# Altium project 2025001 B Soutra Plainsong Metronome.PrjPcb (part 2 of 3)

## Sheet MCU.SchDoc: Plainsong Metronome
size A4; SheetNumber: 5; SheetTotal: 9
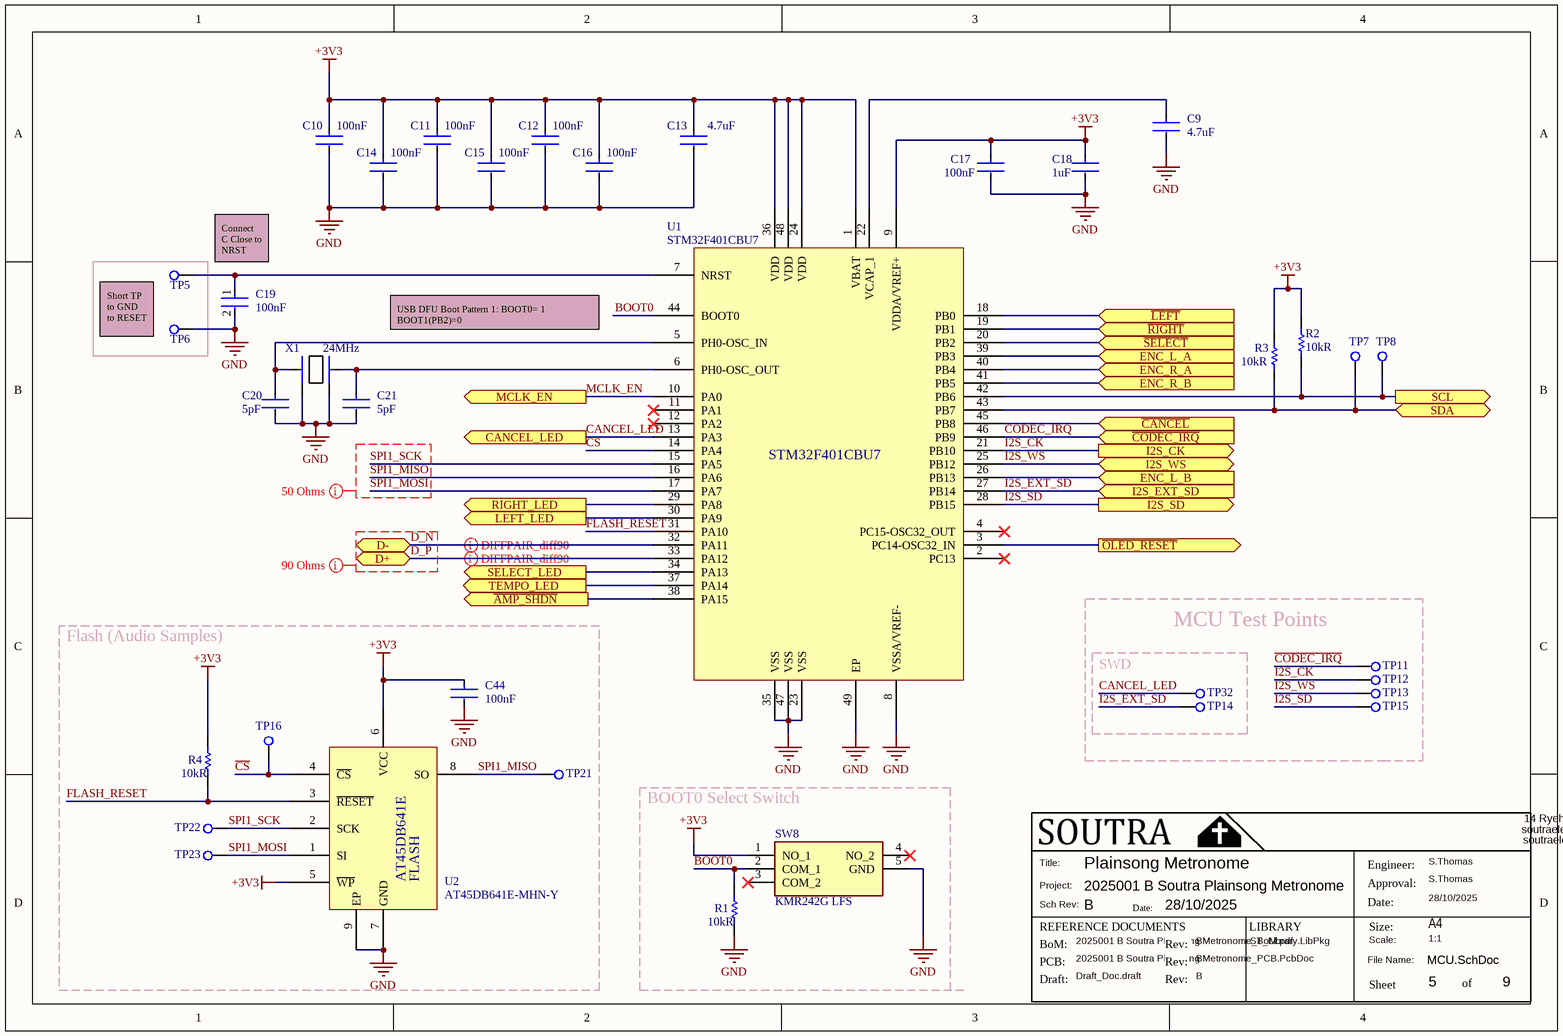
[diagram p5: MCU.SchDoc]

### Parts
C9  value 4.7uF  [CC1206-IPC_A]  (hidden comment: CL31B475KAHNNNE)
C10  value 100nF  [CAPC1005X06L]  (hidden comment: 0402X104M160CT)
C11  value 100nF  [CAPC1005X06L]  (hidden comment: 0402X104M160CT)
C12  value 100nF  [CAPC1005X06L]  (hidden comment: 0402X104M160CT)
C13  value 4.7uF  [CC1206-IPC_A]  (hidden comment: CL31B475KAHNNNE)
C14  value 100nF  [CAPC1005X06L]  (hidden comment: 0402X104M160CT)
C15  value 100nF  [CAPC1005X06L]  (hidden comment: 0402X104M160CT)
C16  value 100nF  [CAPC1005X06L]  (hidden comment: 0402X104M160CT)
C17  value 100nF  [CAPC1005X06L]  (hidden comment: 0402X104M160CT)
C18  value 1uF  [CAPC1005X06L]  (hidden comment: CC0402KRX5R6BB105)
C19  value 100nF  [CAPC1005X06L]  (hidden comment: 0402X104M160CT)
C20  value 5pF  [CAPC1005X06L]  (hidden comment: CC0402CRNPO9BN5R0)
C21  value 5pF  [CAPC1005X06L]  (hidden comment: CC0402CRNPO9BN5R0)
C44  value 100nF  [CAPC1005X06L]  (hidden comment: 0402X104M160CT)
R1  value 10kR  [RESC_0805_2013X50X30LL20T20]  (hidden comment: RC0805JR-0710KL)
R2  value 10kR  [RESC_0603_1608X06L]  (hidden comment: RK73B1JTTD103J)
R3  value 10kR  [RESC_0603_1608X06L]  (hidden comment: RK73B1JTTD103J)
R4  value 10kR  [RESC_0805_2013X50X30LL20T20]  (hidden comment: RC0805JR-0710KL)
SW8  KMR242G LFS  [KMR242GLFS]
TP5  TP_CIRCLE_R1  [TP_CIRCLE_R1]  (value not drawn)
TP6  TP_CIRCLE_R1  [TP_CIRCLE_R1]  (value not drawn)
TP7  TP_CIRCLE_R1  [TP_CIRCLE_R1]  (value not drawn)
TP8  TP_CIRCLE_R1  [TP_CIRCLE_R1]  (value not drawn)
TP11  TP_CIRCLE_R1  [TP_CIRCLE_R1]  (value not drawn)
TP12  TP_CIRCLE_R1  [TP_CIRCLE_R1]  (value not drawn)
TP13  TP_CIRCLE_R1  [TP_CIRCLE_R1]  (value not drawn)
TP14  TP_CIRCLE_R1  [TP_CIRCLE_R1]  (value not drawn)
TP15  TP_CIRCLE_R1  [TP_CIRCLE_R1]  (value not drawn)
TP16  TP_CIRCLE_R1  [TP_CIRCLE_R1]  (value not drawn)
TP21  TP_CIRCLE_R1  [TP_CIRCLE_R1]  (value not drawn)
TP22  TP_CIRCLE_R1  [TP_CIRCLE_R1]  (value not drawn)
TP23  TP_CIRCLE_R1  [TP_CIRCLE_R1]  (value not drawn)
TP32  TP_CIRCLE_R1  [TP_CIRCLE_R1]  (value not drawn)
U1  STM32F401CBU7  [UFQFPN50P700X700X60_HS-49L]
U2  AT45DB641E-MHN-Y  [QFN127P600X500X60_HS-9L]
X1  value 24MHz  [OSCSC1-85x1-55P2-55X2-05Y0-05_4MFR]  (hidden comment: MCSJK-7E-24.00-8-10-60-B-10)

### Blocks framed on the sheet
Flash (Audio Samples): C44 R4 TP16 TP21-TP23 U2
MCU Test Points: TP11-TP13 TP15
SWD: TP14 TP32

### Ports
CANCEL_LED (out, see Block Diagram[2C], IOb[3B]), D+ (bidir, see Block Diagram[3C], IOa[2A]), D- (bidir, see Block Diagram[3C], IOa[2A]), ENC_L_A (in, see Block Diagram[2C], IOb[2C]), ENC_L_B (in, see Block Diagram[2C], IOb[2C]), ENC_R_A (in, see Block Diagram[2C], IOb[2A]), ENC_R_B (in, see Block Diagram[2C], IOb[2B]), I2S_CK (out, see Block Diagram[3A], CODEC[2B]), I2S_EXT_SD (in, see Block Diagram[3A], CODEC[3B]), I2S_SD (out, see Block Diagram[3B], CODEC[2B]), I2S_WS (bidir, see Block Diagram[3A], CODEC[2B]), LEFT_LED (out, see Block Diagram[2C], IOb[2B]), MCLK_EN (out, see Block Diagram[3B], CODEC[1B]), RIGHT_LED (out, see Block Diagram[2C], IOb[4B]), SCL (out, see Block Diagram[3B], CODEC[2B], IOa[1C]), SDA (bidir, see Block Diagram[3B], CODEC[2B], IOa[1C]), SELECT_LED (out, see Block Diagram[2C], IOb[3B]), TEMPO_LED (out, see Block Diagram[2B], IOb[4B]), ~{AMP_SHDN} (out, see Block Diagram[3B], Amplifiers[1B]), ~{CANCEL} (in, see Block Diagram[2C], IOb[3A]), ~{CODEC_IRQ} (in, see Block Diagram[3B], CODEC[3B]), ~{LEFT} (in, see Block Diagram[2B], IOb[3A]), ~{OLED_RESET} (out, see Block Diagram[3C], IOa[1C]), ~{RIGHT} (in, see Block Diagram[2C], IOb[4A]), ~{SELECT} (in, see Block Diagram[2B], IOb[3A])

### Nets
+3V3: C10.1 C11.1 C12.1 C13.1 C14.1 C15.1 C16.1 C17.1 C18.1 C44.1 R2.2 R3.2 R4.2 SW8.1(NO_1) U1.1(VBAT) U1.9(VDDA/VREF+) U1.24(VDD) U1.36(VDD) U1.48(VDD) U2.5(~{WP}) U2.6(VCC)
GND: C9.2 C10.2 C11.2 C12.2 C13.2 C14.2 C15.2 C16.2 C17.2 C18.2 C19.2 C20.2 C21.2 C44.2 R1.1 SW8.5(GND) TP6.1 U1.8(VSSA/VREF-) U1.23(VSS) U1.35(VSS) U1.47(VSS) U1.49(EP) U2.7(GND) U2.9(EP) X1.2 X1.4
~{AMP_SHDN}: U1.38(PA15) ; port ~{AMP_SHDN}
~{CODEC_IRQ}: TP11.1 U1.46(PB9) ; port ~{CODEC_IRQ}
~{CS}: TP16.1 U1.14(PA4) U2.4(~{CS})
BOOT0: R1.2 SW8.2(COM_1) U1.44(BOOT0)
CANCEL_LED: TP32.1 U1.13(PA3) ; port CANCEL_LED
D_N: U1.32(PA11) ; port D-
D_P: U1.33(PA12) ; port D+
FLASH_RESET: R4.1 U1.31(PA10) U2.3(~{RESET})
I2S_CK: TP12.1 U1.21(PB10) ; port I2S_CK
I2S_EXT_SD: TP14.1 U1.27(PB14) ; port I2S_EXT_SD
I2S_SD: TP15.1 U1.28(PB15) ; port I2S_SD
I2S_WS: TP13.1 U1.25(PB12) ; port I2S_WS
MCLK_EN: U1.10(PA0) ; port MCLK_EN
SPI1_MISO: TP21.1 U1.16(PA6) U2.8(SO)
SPI1_MOSI: TP23.1 U1.17(PA7) U2.1(SI)
SPI1_SCK: TP22.1 U1.15(PA5) U2.2(SCK)
NetC9_1: C9.1 U1.22(VCAP_1)
NetC19_1: C19.1 TP5.1 U1.7(NRST)
NetC20_1: C20.1 U1.5(PH0-OSC_IN) X1.1
NetC21_1: C21.1 U1.6(PH0-OSC_OUT) X1.3
NetJ6_16: U1.3(PC14-OSC32_IN) ; port ~{OLED_RESET}
NetJ6_20: R2.1 TP8.1 U1.42(PB6) ; port SCL
NetJ6_21: R3.1 TP7.1 U1.43(PB7) ; port SDA
NetR32_1: U1.41(PB5) ; port ENC_R_B
NetR33_1: U1.40(PB4) ; port ENC_R_A
NetR34_1: U1.18(PB0) ; port ~{LEFT}
NetR35_1: U1.20(PB2) ; port ~{SELECT}
NetR36_1: U1.45(PB8) ; port ~{CANCEL}
NetR37_1: U1.19(PB1) ; port ~{RIGHT}
NetR38_1: U1.30(PA9) ; port LEFT_LED
NetR39_1: U1.34(PA13) ; port SELECT_LED
NetR41_1: U1.29(PA8) ; port RIGHT_LED
NetR43_1: U1.26(PB13) ; port ENC_L_B
NetR44_1: U1.39(PB3) ; port ENC_L_A
NetR45_1: U1.37(PA14) ; port TEMPO_LED

Not connected (* = marked no-connect by the designer): SW8 3(COM_2)* 4(NO_2)*; U1 2(PC13)* 4(PC15-OSC32_OUT)* 11(PA1)* 12(PA2)*

### Layout directives
mark named 90 Ohms: D_N, D_P
rule Width Constraint [Pref Impedance = 50.00ohms    Min Impedance = 50.00ohms    Max Impedance = 50.00ohms]: SPI1_MISO, SPI1_MOSI, SPI1_SCK
differential pair; differential pair class diff90; differential pair; differential pair: D_N, D_P

### Notes on the sheet
- Connect C Close to NRST
- Short TP to GND to RESET
- USB DFU Boot Pattern 1: BOOT0= 1    BOOT1(PB2)=0
- (near SW8) BOOT0 Select Switch
- Title:
- Project:
- Sch Rev:
- Date:
- Engineer:
- Approval:
- REFERENCE DOCUMENTS
- BoM:
- PCB:
- Draft:
- Rev:
- LIBRARY
- File Name:
- Scale:
- Size:
- Sheet
- A4
- of
- (in symbol AT45DB641E-MHN-Y) AT45DB641E

### Library data of the parts
C9 C13 = CL31B475KAHNNNE: Ceramic Capacitor, Multilayer, Ceramic, 25V, 10% +Tol, 10% -Tol, X7R, 15% TC, 4.7uF, Surface Mount, 1206; Manufacturer: Samsung; Multilayer: Yes; Supplier: Digikey; Supplier Part Number: 1276-1055-1-ND; Manufacturer Part Number: CL31B475KAHNNNE; RoHS: Yes; Category: Ceramic Capacitors; Stock: 245034; Pricing: 1=0.18, 10=0.116, 50=0.0732, 100=0.0585, 500=0.04228, 1000=0.0374 (USD); Mounting Technology: Surface Mount; Pins: 2; Dielectric Material: Ceramic; Package Shape: Rectangular; Case/Package: 1206; Terminal Finish: Nickel; Min Operating Temperature: -55°C; Max Operating Temperature: 125°C; JESD-609 Code: e3; Capacitor Type: Ceramic; Tolerance  (fill in as +-): 10%; Package Style: SMTMeter; Packaging: Tape and Reel; Tolerance (fill in as +-): 10%; Rated DC Voltage (URdc): 25V; Temperature Characteristics Code: X7R; Termination: Wraparound; Length: 3.2mm; Width: 1.6mm; Height: 1.8mm; Reach SVHC Compliant: Yes; RoHS Compliant: Yes; ComponentLink1URL: https://datasheet.ciiva.com:443/pdfs/VipMasterIC/IC/SEMS/SEMS-S-A0008522756/SEMS-S-A0008522493-1.pdf?src-supplier=IHS+Markit; ComponentLink1Description: https://datasheet.ciiva.com:443/pdfs/VipMasterIC/IC/SEMS/SEMS-S-A0008522756/SEMS-S-A0008522493-1.pdf?src-supplier=IHS+Markit; ComponentLink2URL: https://datasheet.ciiva.com/25728/cl31b475kahnnne-25728538.pdf?src-supplier=Digikey; ComponentLink2Description: https://datasheet.ciiva.com/25728/cl31b475kahnnne-25728538.pdf?src-supplier=Digikey; ComponentLink3URL: https://datasheet.ciiva.com/29200/452772-da-01-en-vs-kondensator-1206-29200897.pdf?src-supplier=Conrad; ComponentLink3Description: https://datasheet.ciiva.com/29200/452772-da-01-en-vs-kondensator-1206-29200897.pdf?src-supplier=Conrad; ComponentLink4URL: https://datasheet.ciiva.com/29200/452785-da-01-en-vs-kondensator-1206-29200901.pdf?src-supplier=Conrad; ComponentLink4Description: https://datasheet.ciiva.com/29200/452785-da-01-en-vs-kondensator-1206-29200901.pdf?src-supplier=Conrad; ComponentLink5URL: https://datasheet.ciiva.com/26310/mlcc-catalogdownload2013-eng-26310092.pdf?src-supplier=Distrelec; ComponentLink5Description: https://datasheet.ciiva.com/26310/mlcc-catalogdownload2013-eng-26310092.pdf?src-supplier=Distrelec; ComponentLink6URL: https://datasheet.ciiva.com/16428/cl10c1r5bb8nnnc-16428942.pdf?src-supplier=Future+Electronics; ComponentLink6Description: https://datasheet.ciiva.com/16428/cl10c1r5bb8nnnc-16428942.pdf?src-supplier=Future+Electronics; Supplier 1: Farnell; Supplier Part Number 1: 3013532; Pricing 1: 5=0.08, 50=0.05
C10-C12 C14-C17 C19 C44 = 0402X104M160CT: Ceramic Capacitor, Multilayer, Ceramic, 16V, 20% +Tol, 20% -Tol, X5R, 15% TC, 0.1uF, Surface Mount, 0402; Manufacturer: Walsin Technologies; Alternative Part: 885012105016; Alternative Part Manufacturer: WURTH; Multilayer: Yes; Supplier: Farnell; Supplier Part Number: 2524808; Manufacturer Part Number: 0402X104M160CT; RoHS: Yes; Category: Ceramic Capacitors; Stock: 1101; Pricing: 10=0.0047, 100=0.0043; Mounting Technology: Surface Mount; Pins: 2; Dielectric Material: Ceramic; Package Shape: Rectangular; Case/Package: 0402; Terminal Finish: Nickel; Min Operating Temperature: -55°C; Max Operating Temperature: 85°C; JESD-609 Code: e3; Capacitor Type: Ceramic; Tolerance  (fill in as +-): 20%; Package Style: SMTMeter; Packaging: Tape and Reel; Tolerance (fill in as +-): 20%; Rated DC Voltage (URdc): 16V; Temperature Characteristics Code: X5R; Termination: Wraparound; Length: 1mm; Width: 0.5mm; Height: 0.5mm; Reach SVHC Compliant: Yes; RoHS Compliant: Yes; ComponentLink1URL: https://datasheet.ciiva.com:443/pdfs/VipMasterIC/IC/WATC/WATC-S-A0009550342/WATC-S-A0009550342-1.pdf?src-supplier=IHS+Markit; ComponentLink1Description: https://datasheet.ciiva.com:443/pdfs/VipMasterIC/IC/WATC/WATC-S-A0009550342/WATC-S-A0009550342-1.pdf?src-supplier=IHS+Markit; ComponentLink2URL: http://www.farnell.com/datasheets/2009679.pdf?src-supplier=Farnell; ComponentLink2Description: http://www.farnell.com/datasheets/2009679.pdf?src-supplier=Farnell; ComponentLink3URL: http://www.farnell.com/datasheets/2340522.pdf?src-supplier=Farnell; ComponentLink3Description: http://www.farnell.com/datasheets/2340522.pdf?src-supplier=Farnell; ComponentLink4URL: https://datasheet.octopart.com/0402X104M160CT-Walsin-Technologies-datasheet-85392065.pdf?src-supplier=Element14; ComponentLink4Description: https://datasheet.octopart.com/0402X104M160CT-Walsin-Technologies-datasheet-85392065.pdf?src-supplier=Element14; ComponentLink5URL: https://datasheet.octopart.com/0402X104M160CT-Walsin-Technologies-datasheet-136037192.pdf?src-supplier=TECHDesign; ComponentLink5Description: https://datasheet.octopart.com/0402X104M160CT-Walsin-Technologies-datasheet-136037192.pdf?src-supplier=TECHDesign; Supplier Part Number 1: 1292-0402X104M160CT-ND; Supplier 1: Digikey; Pricing 1: 1=0.08, 10=0.023, 50=0.013, 100=0.01; Alternative Part Supplier: Farnell; Alternative Part Supplier Part Number: 2533933
C18 = CC0402KRX5R6BB105: Ceramic Capacitor, Multilayer, Ceramic, 10V, 10% +Tol, 10% -Tol, X5R, 15% TC, 1uF, Surface Mount, 0402; Manufacturer: Yageo; Alternative Part: 0402ZD105KAT2A; Alternative Part Manufacturer: KYOCERA AVX; Multilayer: Yes; Supplier: Farnell; Supplier Part Number: 1458896; Manufacturer Part Number: CC0402KRX5R6BB105; RoHS: Yes; Category: Ceramic Capacitors; Stock: 12220000; Pricing: 10=0.039, 100=0.023; Mounting Technology: Surface Mount; Pins: 2; Dielectric Material: Ceramic; Package Shape: Rectangular; Case/Package: 0402; Terminal Finish: Nickel; Min Operating Temperature: -55°C; Max Operating Temperature: 85°C; JESD-609 Code: e3; Capacitor Type: Ceramic; Tolerance  (fill in as +-): 10%; Package Style: SMTMeter; Packaging: Tape and Reel; Tolerance (fill in as +-): 10%; Rated DC Voltage (URdc): 10V; Temperature Characteristics Code: X5R; Termination: Wraparound; Length: 1mm; Width: 0.5mm; Height: 0.5mm; Reach SVHC Compliant: Yes; RoHS Compliant: Yes; ComponentLink1URL: https://datasheet.ciiva.com:443/pdfs/VipMasterIC/IC/YAGO/YAGO-S-A0006851646/YAGO-S-A0006851646-1.pdf?src-supplier=IHS+Markit; ComponentLink1Description: https://datasheet.ciiva.com:443/pdfs/VipMasterIC/IC/YAGO/YAGO-S-A0006851646/YAGO-S-A0006851646-1.pdf?src-supplier=IHS+Markit; ComponentLink2URL: https://datasheet.ciiva.com/176/upy-gphc-x5r-4v-to-50v-12-176704.pdf?src-supplier=Digi-Key; ComponentLink2Description: https://datasheet.ciiva.com/176/upy-gphc-x5r-4v-to-50v-12-176704.pdf?src-supplier=Digi-Key; ComponentLink3URL: https://datasheet.ciiva.com/176/mlccorderingcode-176705.pdf?src-supplier=Digi-Key; ComponentLink3Description: https://datasheet.ciiva.com/176/mlccorderingcode-176705.pdf?src-supplier=Digi-Key; ComponentLink4URL: https://datasheet.ciiva.com/176/mlccorderingcode-176706.pdf?src-supplier=Digi-Key; ComponentLink4Description: https://datasheet.ciiva.com/176/mlccorderingcode-176706.pdf?src-supplier=Digi-Key; Supplier 1: Digikey; Supplier Part Number 1: 311-1439-1-ND; Pricing 1: 1=0.08, 10=0.058, 50=0.034, 100=0.027; Alternative Part Supplier: Farnell; Alternative Part Supplier Part Number: 1740588
C20 C21 = CC0402CRNPO9BN5R0: Ceramic Capacitor, Multilayer, Ceramic, 50V, 5% +Tol, 5% -Tol, C0G, -/+30ppm/Cel TC, 0.000005uF, Surface Mount, 0402; Manufacturer: Yageo; Alternative Part: GJM1555C1H5R0CB01D; Alternative Part Manufacturer: Murata; Multilayer: Yes; Supplier 1: Farnell; Supplier Part Number 1: 3369083; Manufacturer Part Number: CC0402CRNPO9BN5R0; RoHS: Yes; Category: Ceramic Capacitors; Stock 1: 8005; Pricing 1: 10=0.014, 100=0.008; Mounting Technology: Surface Mount; Pins: 2; Dielectric Material: Ceramic; Package Shape: Rectangular; Case/Package: 0402; Terminal Finish: Nickel; Min Operating Temperature: -55°C; Max Operating Temperature: 125°C; JESD-609 Code: e3; Capacitor Type: Ceramic; Tolerance  (fill in as +-): 5%; Packaging: Tape and Reel; Tolerance (fill in as +-): 5%; Rated DC Voltage (URdc): 50V; Temperature Characteristics Code: C0G; Termination: Wraparound; Reach SVHC Compliant: Yes; RoHS Compliant: Yes; ComponentLink1URL: https://datasheet.ciiva.com:443/pdfs/VipMasterIC/IC/YAGO/YAGOS02763/YAGOS02763-1.pdf?src-supplier=IHS+Markit; ComponentLink1Description: https://datasheet.ciiva.com:443/pdfs/VipMasterIC/IC/YAGO/YAGOS02763/YAGOS02763-1.pdf?src-supplier=IHS+Markit; ComponentLink2URL: https://datasheet.ciiva.com/144/mlccorderingcode-144574.pdf?src-supplier=Digikey; ComponentLink2Description: https://datasheet.ciiva.com/144/mlccorderingcode-144574.pdf?src-supplier=Digikey; ComponentLink3URL: https://datasheet.ciiva.com/144/mlccorderingcode-144575.pdf?src-supplier=Digikey; ComponentLink3Description: https://datasheet.ciiva.com/144/mlccorderingcode-144575.pdf?src-supplier=Digikey; ComponentLink4URL: https://datasheet.ciiva.com/26862/getdatasheetpartid-703288-26862583.pdf?src-supplier=Verical; ComponentLink4Description: https://datasheet.ciiva.com/26862/getdatasheetpartid-703288-26862583.pdf?src-supplier=Verical; ComponentLink5URL: https://datasheet.ciiva.com/144/mlccorderingcode-144576.pdf?src-supplier=Digikey; ComponentLink5Description: https://datasheet.ciiva.com/144/mlccorderingcode-144576.pdf?src-supplier=Digikey; Supplier 2: Digikey; Supplier Part Number 2: 311-1010-1-ND; Stock 2: 7538; Pricing 2: 1=0.08, 10=0.017, 50=0.009, 100=0.007; Alternative Part Supplier: Farnell; Alternative Part Supplier Part Number: 3346199
R1 R4 = RC0805JR-0710KL: Fixed Resistor, Metal Glaze/thick Film, 0.125W, 10000ohm, 150V, 5% +/-Tol, 100ppm/Cel, Surface Mount, 0805; Manufacturer: Yageo; Alternative Part: MCMR08X103 JTL; Additional Feature: LASER TRIMMABLE; Power: 125mW; Rated Temperature: 70°C; Temperature Coefficient: 100ppm/°C; Package Height: 0.5mm; Package Length: 2mm; Package Width: 1.25mm; Supplier: Farnell; Supplier Part Number: 9234136; Manufacturer Part Number: RC0805JR-0710KL; RoHS: Yes; Category: Chip SMD Resistors; Stock: 893694; Pricing: 10=0.013, 100=0.007, 500=0.006; Mounting Technology: Surface Mount; Pins: 2; Package Shape: Rectangular; Case/Package: 0805; Terminal Finish: Nickel; Min Operating Temperature: -55°C; Max Operating Temperature: 155°C; Tolerance: 5%; JESD-609 Code: e3; Resistor Type: FIXED RESISTOR; Construction: Chip; Package Style: SMTMeter; Packaging: Tape and Reel; Technology: METAL GLAZE/THICK FILM; Termination: Wraparound; Working Voltage: 150V; Reach SVHC Compliant: Yes; RoHS Compliant: Yes; ComponentLink1URL: https://datasheet.ciiva.com:443/pdfs/VipMasterIC/IC/YAGO/YAGO-S-A0008145938/YAGO-S-A0008145938-1.pdf?src-supplier=IHS+Markit; ComponentLink1Description: https://datasheet.ciiva.com:443/pdfs/VipMasterIC/IC/YAGO/YAGO-S-A0008145938/YAGO-S-A0008145938-1.pdf?src-supplier=IHS+Markit; ComponentLink2URL: https://datasheet.ciiva.com/7983/444164-7983765.pdf?src-supplier=Element14; ComponentLink2Description: https://datasheet.ciiva.com/7983/444164-7983765.pdf?src-supplier=Element14; ComponentLink3URL: https://datasheet.ciiva.com/7941/444164-7941870.pdf?src-supplier=Element14; ComponentLink3Description: https://datasheet.ciiva.com/7941/444164-7941870.pdf?src-supplier=Element14; ComponentLink4URL: https://datasheet.ciiva.com/7941/444164-7941871.pdf?src-supplier=Element14; ComponentLink4Description: https://datasheet.ciiva.com/7941/444164-7941871.pdf?src-supplier=Element14; Supplier 1: Digikey; Supplier Part Number 1: 311-10KARCT-ND; Pricing 1: 1=0.08, 10=0.018, 50=0.011, 100=0.009; Alternative Part Supplier: Farnell; Alternative Part Supplier Part Number: 2073612
R2 R3 = RK73B1JTTD103J: Fixed Resistor, Metal Glaze/thick Film, 0.1W, 10000ohm, 75V, 5% +/-Tol, 200ppm/Cel, Surface Mount, 0603; Manufacturer: KOA Speer; Alternative Part: RMCF0603FT10K0; Alternative Part Manufacturer: Stackpole Electronics Inc; Power: 100mW; Rated Temperature: 70°C; Temperature Coefficient: 200ppm/°C; Package Height: 0.45mm; Package Length: 1.6mm; Package Width: 0.8mm; Reference Standard: AEC-Q200; Supplier: Farnell; Supplier Part Number: 4009056; Manufacturer Part Number: RK73B1JTTD103J; RoHS: Yes; Category: Chip SMD Resistors; Stock: 750000; Pricing: 10=0.009, 100=0.003; Mounting Technology: Surface Mount; Pins: 2; Case/Package: 0603; Terminal Finish: Nickel; Min Operating Temperature: -55°C; Max Operating Temperature: 155°C; Tolerance: 5%; JESD-609 Code: e3; Resistor Type: FIXED RESISTOR; Construction: Rectangular; Package Style: SMTMeter; Packaging: Tape and Reel; Technology: METAL GLAZE/THICK FILM; Termination: Wraparound; Working Voltage: 75V; Reach SVHC Compliant: Yes; RoHS Compliant: Yes; ComponentLink1URL: https://datasheet.ciiva.com:443/pdfs/VipMasterIC/IC/KOAS/KOAS-S-A0009586303/KOAS-S-A0009586303-1.pdf?src-supplier=IHS+Markit; ComponentLink1Description: https://datasheet.ciiva.com:443/pdfs/VipMasterIC/IC/KOAS/KOAS-S-A0009586303/KOAS-S-A0009586303-1.pdf?src-supplier=IHS+Markit; ComponentLink2URL: https://datasheet.ciiva.com/34302/1877832-34302947.pdf?src-supplier=Jameco; ComponentLink2Description: https://datasheet.ciiva.com/34302/1877832-34302947.pdf?src-supplier=Jameco; ComponentLink3URL: https://datasheet.ciiva.com/7773/548635-7773278.pdf?src-supplier=Element14; ComponentLink3Description: https://datasheet.ciiva.com/7773/548635-7773278.pdf?src-supplier=Element14; ComponentLink4URL: https://datasheet.ciiva.com/5554/rk73b-5554408.pdf?src-supplier=Mouser; ComponentLink4Description: https://datasheet.ciiva.com/5554/rk73b-5554408.pdf?src-supplier=Mouser; Supplier 1: Digikey; Supplier Part Number 1: 2019-RK73B1JTTD103JCT-ND; Pricing 1: 1=0.08, 10=0.012, 50=0.0078, 100=0.0064; Alternative Part Supplier: Digikey; Alternative Part Supplier Part Number: RMCF0603FT10K0CT-ND
SW8 = KMR242G LFS: Switch Tactile N.O. SPST Round Button Gull Wing 0.05A 32VDC 1VA 200000Cycle 4N SMD T/R; Manufacturer: C&K Components; Actuator Length: 508µm; Contact Current Rating: 50mA; Contact Resistance: 100mΩ; Electrical Life: 200kcycles; Illumination Type: Non-Illuminated; Insulation Resistance: 1GΩ; Max Voltage Rating (DC): 32V; Number of Positions: 1; Power Rating: 1W; Sealable: IP40; Switch Function: Off-Mom; Switch Travel: 300µm; Supplier: Farnell; Supplier Part Number: 2908777; Manufacturer Part Number: KMR242G LFS; RoHS: Compliant; Category: Tactile Switches; Stock: 46207; Pricing: 10=0.297, 50=0.27, 100=0.258, 250=0.227 (GBP); Case/Package: SMD/SMT; Contact Material: Silver; Contact Plating: Silver; Current Rating: 50mA; Depth: 4.6mm; Height: 1.4mm; Length: 4.2mm; Lifecycle Status: Production; Max Current Rating: 50mA; Max Operating Temperature: 85°C; Mechanical Life: 200kcycles; Min Operating Temperature: -40°C; Mounting Technology: Surface Mount; Operating Force: 4N; Orientation: Straight; Packaging: Tape and Reel; Radiation Hardening: No; REACH SVHC: Yes; Termination: Gull Wing; Throw Configuration: SPST; Voltage Rating (DC): 32V; ComponentLink1URL: https://datasheet.octopart.com:443/KMR242G-LFS-C%26K-Components-datasheet-67873663.pdf?src-supplier=IHS; ComponentLink1Description: https://datasheet.octopart.com:443/KMR242G-LFS-C%26K-Components-datasheet-67873663.pdf?src-supplier=IHS; ComponentLink2URL: https://datasheet.octopart.com:443/KMR242GLFS-C%26K-Components-datasheet-104408627.pdf?src-supplier=Electro+Sonic; ComponentLink2Description: https://datasheet.octopart.com:443/KMR242GLFS-C%26K-Components-datasheet-104408627.pdf?src-supplier=Electro+Sonic; ComponentLink3URL: https://datasheet.octopart.com:443/KMR242GLFS-C%26K-Components-datasheet-13389051.pdf?src-supplier=Electro+Sonic; ComponentLink3Description: https://datasheet.octopart.com:443/KMR242GLFS-C%26K-Components-datasheet-13389051.pdf?src-supplier=Electro+Sonic; ComponentLink4URL: http://sigma.octopart.com:80/reach_statement/ITT-company-18.pdf?src-supplier=Compliance+Statements; ComponentLink4Description: http://sigma.octopart.com:80/reach_statement/ITT-company-18.pdf?src-supplier=Compliance+Statements
TP5-TP8 TP11-TP16 TP21-TP23 TP32 = TP_CIRCLE_R1: Test Point, SMD, Circular, Radius = 1mm
U1 = STM32F401CBU7: RISC Microcontroller, 32-Bit, FLASH, 84MHz, CMOS; Manufacturer: STMicroelectronics; Clock Frequency: 26MHz; Number of I/O Lines: 36; Speed: 84RPM; Max Supply Voltage: 3.6V; Min Supply Voltage: 1.7V; Nominal Supply Voltage: 3.3V; Supplier: Farnell; Supplier Part Number: 2469576; Manufacturer Part Number: STM32F401CBU7; RoHS: Yes; Category: Microcontrollers; Stock: 7280; Pricing: 1=3.42; Case/Package: HVQCCN; Pins: 48; Package Shape: Square; Min Operating Temperature: -40°C; Max Operating Temperature: 105°C; JESD-30 Code: S-XQCC-N48; Package Style: CHIP CARRIER, HEAT SINK/SLUG, VERY THIN PROFILEMeter; Surface Mount: Yes; Technology: CMOS; Terminal Form: No Lead; Terminal Position: QUAD; Length: 7mm; Width: 7mm; Height - Seated (Max): 0.6mm; Terminal Pitch: 0.5mm; Temperature Grade: INDUSTRIAL; Reach SVHC Compliant: Yes; RoHS Compliant: Yes; ComponentLink1URL: https://datasheet.ciiva.com:443/pdfs/VipMasterIC/IC/SGST/SGST-S-A0002802577/SGST-S-A0002802577-1.pdf?src-supplier=IHS+Markit; ComponentLink1Description: https://datasheet.ciiva.com:443/pdfs/VipMasterIC/IC/SGST/SGST-S-A0002802577/SGST-S-A0002802577-1.pdf?src-supplier=IHS+Markit; ComponentLink2URL: http://www.farnell.com/datasheets/2308718.pdf?src-supplier=Farnell; ComponentLink2Description: http://www.farnell.com/datasheets/2308718.pdf?src-supplier=Farnell; ComponentLink3URL: http://www.mouser.com/ds/2/389/stm32f401cb-956305.pdf?src-supplier=Mouser; ComponentLink3Description: http://www.mouser.com/ds/2/389/stm32f401cb-956305.pdf?src-supplier=Mouser; ComponentLink4URL: http://www.st.com/content/ccc/resource/technical/document/datasheet/9e/50/b1/5a/5f/ae/4d/c1/DM00086815.pdf/files/DM00086815.pdf/jcr:content/translations/en.DM00086815.pdf?src-supplier=Digikey; ComponentLink4Description: http://www.st.com/content/ccc/resource/technical/document/datasheet/9e/50/b1/5a/5f/ae/4d/c1/DM00086815.pdf/files/DM00086815.pdf/jcr:content/translations/en.DM00086815.pdf?src-supplier=Digikey; ComponentLink5URL: http://www.st.com/st-web-ui/static/active/en/resource/technical/document/datasheet/DM00102166.pdf?src-supplier=Avnet; ComponentLink5Description: http://www.st.com/st-web-ui/static/active/en/resource/technical/document/datasheet/DM00102166.pdf?src-supplier=Avnet; ComponentLink6URL: https://datasheet.octopart.com/STM32F401CBU7-STMicroelectronics-datasheet-46749032.pdf?src-supplier=Element14; ComponentLink6Description: https://datasheet.octopart.com/STM32F401CBU7-STMicroelectronics-datasheet-46749032.pdf?src-supplier=Element14; ComponentLink7URL: https://datasheet.octopart.com/STM32F401CBU7-STMicroelectronics-datasheet-27616295.pdf?src-supplier=Newark; ComponentLink7Description: https://datasheet.octopart.com/STM32F401CBU7-STMicroelectronics-datasheet-27616295.pdf?src-supplier=Newark; ComponentLink8URL: https://datasheet.octopart.com/STM32F401CBU7-STMicroelectronics-datasheet-68305517.pdf?src-supplier=SHENGYU+ELECTRONICS; ComponentLink8Description: https://datasheet.octopart.com/STM32F401CBU7-STMicroelectronics-datasheet-68305517.pdf?src-supplier=SHENGYU+ELECTRONICS; Supplier 1: Digikey; Supplier Part Number 1: STM32F401CBU7; Pricing 1: 1=4.88, 10=4.38, 25=4.14, 80=3.59
U2 = AT45DB641E-MHN-Y: Flash, 64MX1, PDSO8; Manufacturer: Adesto Technologies; Package Body Material: Plastic; Clock Frequency: 85MHz; Density: 67108864b; Memory Width: 1; Memory Size: 67108864; Number of Words Code: 64M; Operating Mode: SYNCHRONOUS; Parallel/Serial: SERIAL; Programming Voltage: 1.8V; Max Supply Voltage: 3.6V; Min Supply Voltage: 1.7V; Nominal Supply Voltage: 2.3V; Supplier: Farnell; Supplier Part Number: 2910029; Manufacturer Part Number: AT45DB641E-MHN-Y; RoHS: Yes; Category: Memory; Stock: 5373; Pricing: 1=5.02, 10=4.15, 25=3.97, 50=3.80, 100=3.62; Case/Package: HVSON; Pins: 8; Package Shape: Rectangular; Terminal Finish: Nickel; Min Operating Temperature: -40°C; Max Operating Temperature: 85°C; JESD-609 Code: e4; Memory Format: FLASH; Type: NOR TYPE; JESD-30 Code: R-PDSO-N8; Moisture Sensitivity Level: 1; Channels: 1; Organization: 64MX1; Package Style: SMALL OUTLINE, HEAT SINK/SLUG, VERY THIN PROFILEMeter; Peak Reflow Temperature (Cel): 260°C; Surface Mount: Yes; Technology: CMOS; Terminal Form: No Lead; Terminal Position: DUAL; Length: 6mm; Width: 5mm; Height - Seated (Max): 0.6mm; Terminal Pitch: 1.27mm; Temperature Grade: INDUSTRIAL; Reach SVHC Compliant: Yes; RoHS Compliant: Yes; ComponentLink1URL: https://datasheet.ciiva.com:443/pdfs/VipMasterIC/IC/ADET/ADET-S-A0007923472/ADET-S-A0007923472-1.pdf?src-supplier=IHS+Markit; ComponentLink1Description: https://datasheet.ciiva.com:443/pdfs/VipMasterIC/IC/ADET/ADET-S-A0007923472/ADET-S-A0007923472-1.pdf?src-supplier=IHS+Markit; ComponentLink2URL: http://www.farnell.com/datasheets/1809895.pdf?src-supplier=Farnell; ComponentLink2Description: http://www.farnell.com/datasheets/1809895.pdf?src-supplier=Farnell; ComponentLink3URL: http://www.mouser.com/ds/2/590/DS-45DB641E-027-534005.pdf?src-supplier=Mouser; ComponentLink3Description: http://www.mouser.com/ds/2/590/DS-45DB641E-027-534005.pdf?src-supplier=Mouser; ComponentLink4URL: http://www.adestotech.com/sites/default/files/datasheets/DS-45DB641E-027.pdf?src-supplier=Avnet; ComponentLink4Description: http://www.adestotech.com/sites/default/files/datasheets/DS-45DB641E-027.pdf?src-supplier=Avnet; ComponentLink5URL: http://www.adestotech.com/wp-content/uploads/DS-45DB641E-027.pdf?src-supplier=Digikey; ComponentLink5Description: http://www.adestotech.com/wp-content/uploads/DS-45DB641E-027.pdf?src-supplier=Digikey; ComponentLink6URL: http://datasheet.octopart.com/AT45DB641E-MHN-Y-Adesto-Technologies-datasheet-24999053.pdf?src-supplier=Newark; ComponentLink6Description: http://datasheet.octopart.com/AT45DB641E-MHN-Y-Adesto-Technologies-datasheet-24999053.pdf?src-supplier=Newark; ComponentLink7URL: http://www.farnell.com/datasheets/1809895.pdf?src-supplier=Element14; ComponentLink7Description: http://www.farnell.com/datasheets/1809895.pdf?src-supplier=Element14; ComponentLink8URL: https://datasheet.octopart.com/AT45DB641E-MHN-Y-Adesto-Technologies-datasheet-158990717.pdf?src-supplier=SHENGYU+ELECTRONICS; ComponentLink8Description: https://datasheet.octopart.com/AT45DB641E-MHN-Y-Adesto-Technologies-datasheet-158990717.pdf?src-supplier=SHENGYU+ELECTRONICS; Supplier 1: Digikey; Supplier Part Number 1: 1265-1227-ND; Pricing 1: 1=4.65, 10=4.24, 25=4.16, 40=4.13, 80=3.70
X1 = MCSJK-7E-24.00-8-10-60-B-10: Parallel - Fundamental Quartz Crystal; Manufacturer: Multicomp; Supplier 1: Farnell; Supplier Part Number 1: 2853878; Manufacturer Part Number: MCSJK-7E-24.00-8-10-60-B-10; RoHS: No; Stock 1: 1530; Pricing 1: 5=0.232, 50=0.188, 250=0.165, 500=0.15, 1500=0.133, 3000=0.129, 15000=0.125, 30000=0.123 (GBP); RoHS Compliant: Yes

## Sheet Amplifiers.SchDoc: Plainsong Metronome
size A4; SheetNumber: 7; SheetTotal: 9
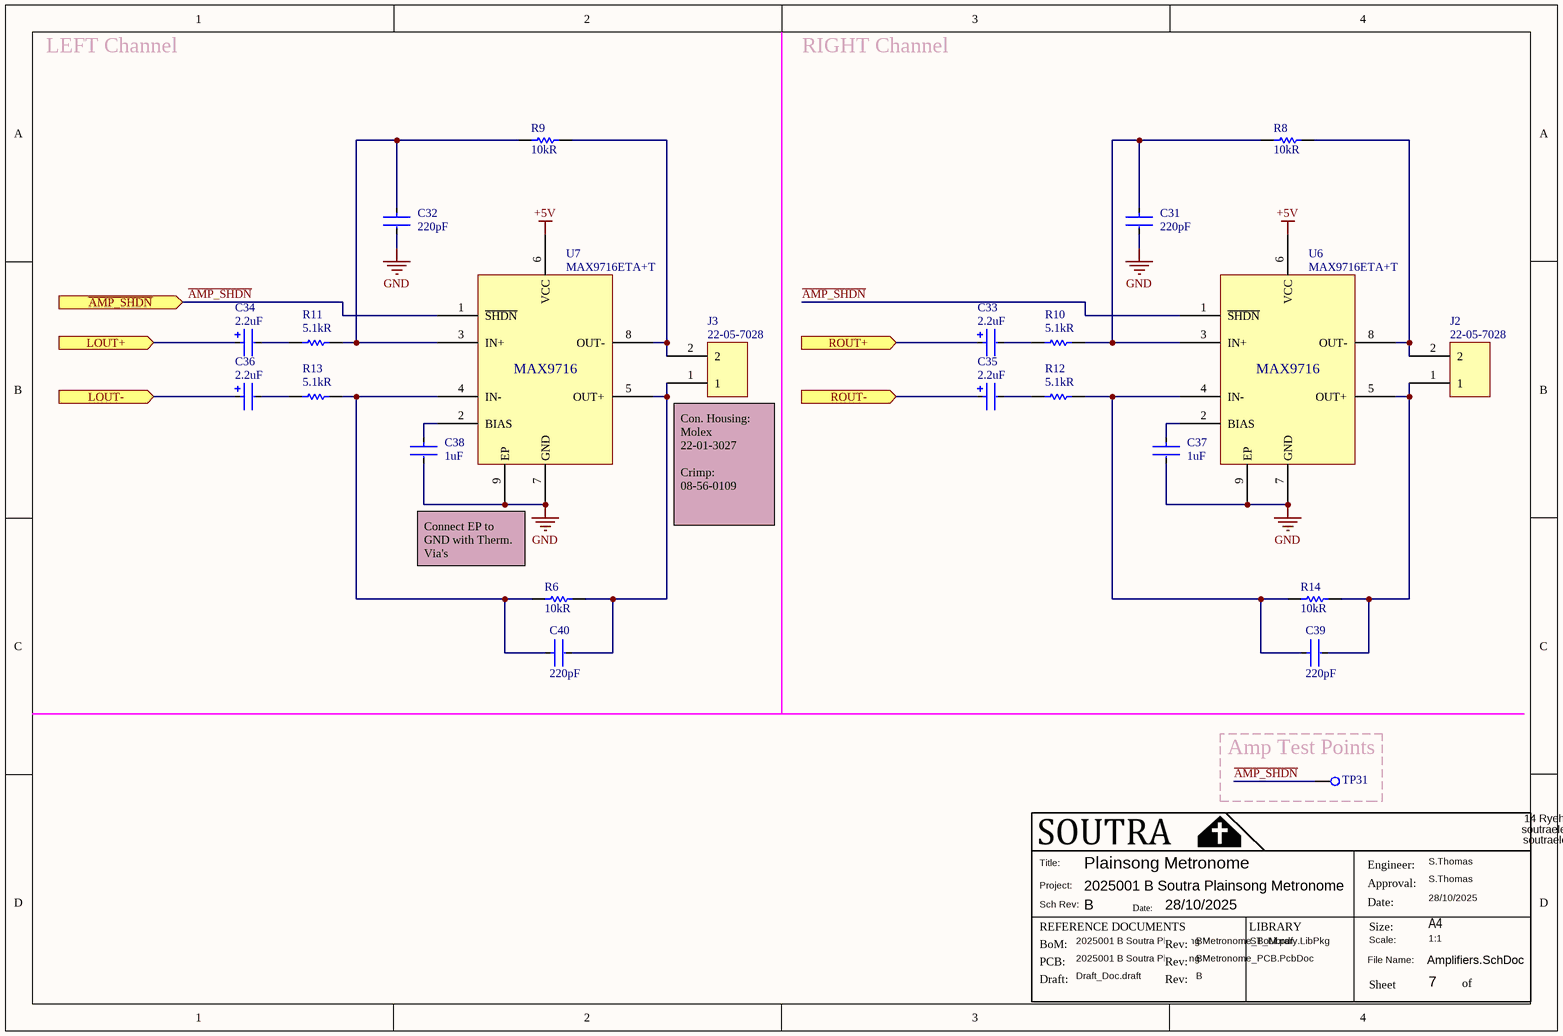
[diagram p6: Amplifiers.SchDoc]

### Parts
C31  value 220pF  [CAPC1005X06L]  (hidden comment: CC0402KPX7R9BB221)
C32  value 220pF  [CAPC1005X06L]  (hidden comment: CC0402KPX7R9BB221)
C33  value 2.2uF  [CAPC2113X120X50ML20T30]  (hidden comment: TAJR225K016RNJ)
C34  value 2.2uF  [CAPC2113X120X50ML20T30]  (hidden comment: TAJR225K016RNJ)
C35  value 2.2uF  [CAPC2113X120X50ML20T30]  (hidden comment: TAJR225K016RNJ)
C36  value 2.2uF  [CAPC2113X120X50ML20T30]  (hidden comment: TAJR225K016RNJ)
C37  value 1uF  [CAPC1005X06L]  (hidden comment: CC0402KRX5R6BB105)
C38  value 1uF  [CAPC1005X06L]  (hidden comment: CC0402KRX5R6BB105)
C39  value 220pF  [CAPC1005X06L]  (hidden comment: CC0402KPX7R9BB221)
C40  value 220pF  [CAPC1005X06L]  (hidden comment: CC0402KPX7R9BB221)
J2  22-05-7028  [J_MOLEX_22-05-7028]
J3  22-05-7028  [J_MOLEX_22-05-7028]
R6  value 10kR  [RESC_0805_2013X50X30LL20T20]  (hidden comment: RC0805JR-0710KL)
R8  value 10kR  [RESC_0805_2013X50X30LL20T20]  (hidden comment: RC0805JR-0710KL)
R9  value 10kR  [RESC_0805_2013X50X30LL20T20]  (hidden comment: RC0805JR-0710KL)
R10  value 5.1kR  [RESC_0603_1608X06L]  (hidden comment: MCMR06X512JTL)
R11  value 5.1kR  [RESC_0603_1608X06L]  (hidden comment: MCMR06X512JTL)
R12  value 5.1kR  [RESC_0603_1608X06L]  (hidden comment: MCMR06X512JTL)
R13  value 5.1kR  [RESC_0603_1608X06L]  (hidden comment: MCMR06X512JTL)
R14  value 10kR  [RESC_0805_2013X50X30LL20T20]  (hidden comment: RC0805JR-0710KL)
TP31  TP_CIRCLE_R1  [TP_CIRCLE_R1]  (value not drawn)
U6  MAX9716ETA+T  [TDFN300X300X80_HS-9L]
U7  MAX9716ETA+T  [TDFN300X300X80_HS-9L]

### Blocks framed on the sheet
Amp Test Points: TP31

### Ports
LOUT+ (in, see Block Diagram[4B], CODEC[3B], IOa[3A]), LOUT- (in, see Block Diagram[4B], CODEC[3B]), ROUT+ (in, see Block Diagram[4B], CODEC[3B], IOa[3A]), ROUT- (in, see Block Diagram[4B], CODEC[3B]), ~{AMP_SHDN} (in, see Block Diagram[3B], MCU[2C])

### Nets
+5V: U6.6(VCC) U7.6(VCC)
GND: C31.2 C32.2 C37.2 C38.2 U6.7(GND) U6.9(EP) U7.7(GND) U7.9(EP)
~{AMP_SHDN}: TP31.1 U6.1(~{SHDN}) U7.1(~{SHDN}) ; port ~{AMP_SHDN}
LOUT+: C34.1 ; port LOUT+
LOUT-: C36.1 ; port LOUT-
ROUT+: C33.1 ; port ROUT+
ROUT-: C35.1 ; port ROUT-
NetC31_1: C31.1 R8.2 R10.2 U6.3(IN+)
NetC32_1: C32.1 R9.2 R11.2 U7.3(IN+)
NetC33_2: C33.2 R10.1
NetC34_2: C34.2 R11.1
NetC35_2: C35.2 R12.1
NetC36_2: C36.2 R13.1
NetC37_1: C37.1 U6.2(BIAS)
NetC38_1: C38.1 U7.2(BIAS)
NetC39_1: C39.1 R12.2 R14.2 U6.4(IN-)
NetC39_2: C39.2 J2.1 R14.1 U6.5(OUT+)
NetC40_1: C40.1 R6.2 R13.2 U7.4(IN-)
NetC40_2: C40.2 J3.1 R6.1 U7.5(OUT+)
NetJ2_2: J2.2 R8.1 U6.8(OUT-)
NetJ3_2: J3.2 R9.1 U7.8(OUT-)

### Notes on the sheet
- LEFT Channel
- RIGHT Channel
- (near J3) Con. Housing:
  Molex 22-01-3027
  Crimp:
  08-56-0109
- Connect EP to GND with Therm. Via's
- Title:
- Project:
- Sch Rev:
- Date:
- Engineer:
- Approval:
- REFERENCE DOCUMENTS
- BoM:
- PCB:
- Draft:
- Rev:
- LIBRARY
- File Name:
- Scale:
- Size:
- Sheet
- A4
- of
- (in symbol MAX9716ETA+T) MAX9716

### Library data of the parts
C31 C32 C39 C40 = CC0402KPX7R9BB221: Ceramic Capacitor, Multilayer, Ceramic, 50V, 10% +Tol, 10% -Tol, X7R, 15% TC, 0.00022uF, Surface Mount, 0402; Manufacturer: Yageo; Alternative Part: MC0402B221K500CT; Multilayer: Yes; Supplier 1: Farnell; Supplier Part Number 1: 4254872; Manufacturer Part Number: CC0402KPX7R9BB221; RoHS: Yes; Category: Ceramic Capacitors; Stock 1: 49750; Pricing 1: 10=0.0069, 500=0.0055, 2500=0.0042, 10000=0.003, 25000=0.0029, 50000=0.0028, 250000=0.0027, 500000=0.0026 (GBP); Mounting Technology: Surface Mount; Pins: 2; Dielectric Material: Ceramic; Package Shape: Rectangular; Case/Package: 0402; Terminal Finish: Nickel; Min Operating Temperature: -55°C; Max Operating Temperature: 125°C; JESD-609 Code: e3; Capacitor Type: Ceramic; Tolerance  (fill in as +-): 10%; Package Style: SMTMeter; Packaging: Tape and Reel; Tolerance (fill in as +-): 10%; Rated DC Voltage (URdc): 50V; Temperature Characteristics Code: X7R; Termination: Wraparound; Length: 1mm; Width: 0.5mm; Height: 0.5mm; Reach SVHC Compliant: Yes; RoHS Compliant: Yes; ComponentLink1URL: https://datasheet.ciiva.com:443/pdfs/VipMasterIC/IC/YAGO/YAGO-S-A0003557223/YAGO-S-A0003557223-1.pdf?src-supplier=IHS+Markit; ComponentLink1Description: https://datasheet.ciiva.com:443/pdfs/VipMasterIC/IC/YAGO/YAGO-S-A0003557223/YAGO-S-A0003557223-1.pdf?src-supplier=IHS+Markit; ComponentLink2URL: https://datasheet.ciiva.com/13208/upy-gphc-x7r-6-3v-to-50v-8-12304-13208487.pdf?src-supplier=Mouser; ComponentLink2Description: https://datasheet.ciiva.com/13208/upy-gphc-x7r-6-3v-to-50v-8-12304-13208487.pdf?src-supplier=Mouser; Supplier 2: Digikey; Supplier Part Number 2: 311-1035-1-ND; Stock 2: 333936; Pricing 2: 1=0.08, 10=0.016, 50=0.0092, 100=0.007; Alternative Part Supplier: Farnell; Alternative Part Supplier Part Number: 1758981
C33-C36 = TAJR225K016RNJ: Surface Mount Tantalum Capacitor, 2.2 µF, 16 V, 0805 [2012 Metric], ± 10%, 6.5 ohm, R; Manufacturer: AVX Interconnect / Elco; Part Number: TAJR225K016RNJ; Supplier 1: Farnell; Supplier Part Number 1: 2112773; Pricing 1: 5=0.3684, 50=0.2592; Stock 1: 340; Manufacturer Part Number: TAJR225K016RNJ
C37 C38 = CC0402KRX5R6BB105: as C18 on sheet MCU; Supplier: Farnell; Supplier Part Number: 1458896; Manufacturer Part Number: CC0402KRX5R6BB105; RoHS: Yes; Category: Ceramic Capacitors; Stock: 12220000; Pricing: 10=0.039, 100=0.023; Mounting Technology: Surface Mount; Pins: 2; Dielectric Material: Ceramic; Package Shape: Rectangular; Case/Package: 0402; Terminal Finish: Nickel; Min Operating Temperature: -55°C; Max Operating Temperature: 85°C; JESD-609 Code: e3; Capacitor Type: Ceramic; Tolerance  (fill in as +-): 10%; Package Style: SMTMeter; Packaging: Tape and Reel; Tolerance (fill in as +-): 10%; Rated DC Voltage (URdc): 10V; Temperature Characteristics Code: X5R; Termination: Wraparound; Length: 1mm; Width: 0.5mm; Height: 0.5mm; Reach SVHC Compliant: Yes; RoHS Compliant: Yes; ComponentLink1URL: https://datasheet.ciiva.com:443/pdfs/VipMasterIC/IC/YAGO/YAGO-S-A0006851646/YAGO-S-A0006851646-1.pdf?src-supplier=IHS+Markit; ComponentLink1Description: https://datasheet.ciiva.com:443/pdfs/VipMasterIC/IC/YAGO/YAGO-S-A0006851646/YAGO-S-A0006851646-1.pdf?src-supplier=IHS+Markit; ComponentLink2URL: https://datasheet.ciiva.com/176/upy-gphc-x5r-4v-to-50v-12-176704.pdf?src-supplier=Digi-Key; ComponentLink2Description: https://datasheet.ciiva.com/176/upy-gphc-x5r-4v-to-50v-12-176704.pdf?src-supplier=Digi-Key; ComponentLink3URL: https://datasheet.ciiva.com/176/mlccorderingcode-176705.pdf?src-supplier=Digi-Key; ComponentLink3Description: https://datasheet.ciiva.com/176/mlccorderingcode-176705.pdf?src-supplier=Digi-Key; ComponentLink4URL: https://datasheet.ciiva.com/176/mlccorderingcode-176706.pdf?src-supplier=Digi-Key; ComponentLink4Description: https://datasheet.ciiva.com/176/mlccorderingcode-176706.pdf?src-supplier=Digi-Key; Supplier 1: Digikey; Supplier Part Number 1: 311-1439-1-ND; Pricing 1: 1=0.08, 10=0.058, 50=0.034, 100=0.027; Alternative Part Supplier: Farnell; Alternative Part Supplier Part Number: 1740588
J2 J3 = 22-05-7028: Board Connector, 2 Contact(s), 1 Row(s), Male, Right Angle, 0.1 inch Pitch, Solder Terminal, Locking, Natural Insulator, Receptacle; Manufacturer: Molex; Option: General Purpose; Filter Feature: No; Mating Information: MULTIPLE MATING PARTS AVAILABLE; Number of Rows Loaded: 1; Number of Contacts: 2; Contact Pattern: RECTANGULAR; Contact Resistance: 10mR; Contact Style: SQ PIN-SKT; Durability: 50Cycles; Insulation Resistance: 1GR; Polarization Key: POLARIZED HOUSING; Rated Current (Signal): 4A; Body Breadth: 0.228inch; Body Depth: 0.568inch; Body Length: 0.2inch; Plating Thickness: 60uin; Reference Standard: UL; Reliability: COMMERCIAL; Insertion Force-Max: 1.946N; Withdrawl Force-Min: 0.556N; Supplier 1: Farnell; Supplier Part Number 1: 9731601; Manufacturer Part Number: 22-05-7028; RoHS: Yes; Category: Headers and Wire Housings; Mounting Technology: Board; Contact Finish - Mating: TIN (200); Contact Finish - Termination: Tin (Sn); Insulation Color: Natural; Insulation Material: Nylon; Min Operating Temperature: -40°C; Max Operating Temperature: 105°C; Connector Type: BOARD CONNECTOR; Contact Gender: Male; Mixed Contacts: No; Mounting Style: RIGHT ANGLE; Termination: Solder; JESD-609 Code: e3; Body/Shell Style: RECEPTACLE; Number Of Connectors: 1; Number Of PCB Rows: 1; PCB Contact Pattern: RECTANGULAR; Terminal Pitch: 2.54mm; Mating Contact Pitch: 0.1inch; Mounting Option 1: LOCKING; Terminal Length: 0.15inch; Flammability Rating: UL94 V-0; Reach SVHC Compliant: Yes; RoHS Compliant: Yes; DIN Conformance: No; IEC Conformance: No; MIL Conformance: No; ComponentLink1URL: https://datasheet.ciiva.com:443/pdfs/VipMasterIC/IC/MOLE/MOLE-S-A0002841204/MOLE-S-A0002841204-1.pdf?src-supplier=IHS+Markit; ComponentLink1Description: https://datasheet.ciiva.com:443/pdfs/VipMasterIC/IC/MOLE/MOLE-S-A0002841204/MOLE-S-A0002841204-1.pdf?src-supplier=IHS+Markit; ComponentLink2URL: http://www.farnell.com/datasheets/2700806.pdf?src-supplier=Farnell; ComponentLink2Description: http://www.farnell.com/datasheets/2700806.pdf?src-supplier=Farnell; Stock 1: 34887; Pricing 1: 1=0.78, 10=0.64, 50=0.57, 100=0.50; ComponentLink3URL: http://datasheet.octopart.com/22-05-7028-Molex-datasheet-10979095.pdf?src-supplier=Avnet; ComponentLink3Description: http://datasheet.octopart.com/22-05-7028-Molex-datasheet-10979095.pdf?src-supplier=Avnet
R6 R8 R9 R14 = RC0805JR-0710KL: as R1 on sheet MCU; Supplier: Farnell; Supplier Part Number: 9234136; Manufacturer Part Number: RC0805JR-0710KL; RoHS: Yes; Category: Chip SMD Resistors; Stock: 893694; Pricing: 10=0.013, 100=0.007, 500=0.006; Mounting Technology: Surface Mount; Pins: 2; Package Shape: Rectangular; Case/Package: 0805; Terminal Finish: Nickel; Min Operating Temperature: -55°C; Max Operating Temperature: 155°C; Tolerance: 5%; JESD-609 Code: e3; Resistor Type: FIXED RESISTOR; Construction: Chip; Package Style: SMTMeter; Packaging: Tape and Reel; Technology: METAL GLAZE/THICK FILM; Termination: Wraparound; Working Voltage: 150V; Reach SVHC Compliant: Yes; RoHS Compliant: Yes; ComponentLink1URL: https://datasheet.ciiva.com:443/pdfs/VipMasterIC/IC/YAGO/YAGO-S-A0008145938/YAGO-S-A0008145938-1.pdf?src-supplier=IHS+Markit; ComponentLink1Description: https://datasheet.ciiva.com:443/pdfs/VipMasterIC/IC/YAGO/YAGO-S-A0008145938/YAGO-S-A0008145938-1.pdf?src-supplier=IHS+Markit; ComponentLink2URL: https://datasheet.ciiva.com/7983/444164-7983765.pdf?src-supplier=Element14; ComponentLink2Description: https://datasheet.ciiva.com/7983/444164-7983765.pdf?src-supplier=Element14; ComponentLink3URL: https://datasheet.ciiva.com/7941/444164-7941870.pdf?src-supplier=Element14; ComponentLink3Description: https://datasheet.ciiva.com/7941/444164-7941870.pdf?src-supplier=Element14; ComponentLink4URL: https://datasheet.ciiva.com/7941/444164-7941871.pdf?src-supplier=Element14; ComponentLink4Description: https://datasheet.ciiva.com/7941/444164-7941871.pdf?src-supplier=Element14; Supplier 1: Digikey; Supplier Part Number 1: 311-10KARCT-ND; Pricing 1: 1=0.08, 10=0.018, 50=0.011, 100=0.009; Alternative Part Supplier: Farnell; Alternative Part Supplier Part Number: 2073612
R10-R13 = MCMR06X512JTL: Fixed Resistor, 0.1W, 5100ohm, 75V, 5% +/-Tol, 100ppm/Cel, Surface Mount, 0603; Manufacturer: Multicomp; Manufacturer Series: MCMR06; Alternative Part: MCMR06X5101FTL; Power: 100mW; Rated Temperature: 70°C; Temperature Coefficient: 100ppm/°C; Reference Standard: AEC-Q200; Supplier 1: Farnell; Supplier Part Number 1: 2073528; Manufacturer Part Number: MCMR06X512JTL; RoHS: Yes; Category: Chip SMD Resistors; Stock 1: 4951; Pricing 1: 10=0.0065, 100=0.0056, 500=0.0047, 1000=0.004, 2500=0.0027, 5000=0.0021, 25000=0.0016, 50000=0.0013 (GBP); Mounting Technology: Surface Mount; Pins: 2; Package Shape: Rectangular; Case/Package: 0603; Terminal Finish: Tin; Min Operating Temperature: -55°C; Max Operating Temperature: 155°C; Tolerance: 5%; JESD-609 Code: e3; Resistor Type: FIXED RESISTOR; Packaging: Tape and Reel; Termination: Wraparound; Working Voltage: 75V; RoHS Compliant: Yes; ComponentLink1URL: https://datasheet.ciiva.com:443/pdfs/VipMasterIC/IC/SCMP/SCMPS00167/SCMPS00167-1.pdf?src-supplier=IHS+Markit; ComponentLink1Description: https://datasheet.ciiva.com:443/pdfs/VipMasterIC/IC/SCMP/SCMPS00167/SCMPS00167-1.pdf?src-supplier=IHS+Markit; ComponentLink2URL: https://datasheet.ciiva.com/28686/1716707-28686598.pdf?src-supplier=Element14; ComponentLink2Description: https://datasheet.ciiva.com/28686/1716707-28686598.pdf?src-supplier=Element14; Alternative Part Supplier: Farnell; Alternative Part Supplier Part Number: 2073522
TP31 = TP_CIRCLE_R1: Test Point, SMD, Circular, Radius = 1mm
U6 U7 = MAX9716ETA+T: Audio Amplifier, 1.4W, 1 Channel(s), 1 Func, BICMOS; Manufacturer: Maxim; Bandwidth-Nom: 22kHz; Number of Channels: 1; Package Equivalence Code: SOLCC8,.12,25; Power Supplies: 3/5V; Max Supply Current: 8mA; Max Supply Voltage: 5.5V; Min Supply Voltage: 2.7V; Qualification Status: Not Qualified; Supplier: Farnell; Supplier Part Number: 2516304; Manufacturer Part Number: MAX9716ETA+T; RoHS: Yes; Category: Amplifiers - Audio; Stock: 3265; Pricing: 1=1.41, 10=1.26, 25=1.19, 100=0.982; Case/Package: HVSON; Pins: 8; Package Shape: Square; Terminal Finish: Tin; Min Operating Temperature: -40°C; Max Operating Temperature: 85°C; JESD-609 Code: e3; Consumer IC Type: AUDIO AMPLIFIER; JESD-30 Code: S-XDSO-N8; Moisture Sensitivity Level: 1; Channels: 1; Output Power-Nom: 1.4W; Package Style: SMALL OUTLINE, HEAT SINK/SLUG, VERY THIN PROFILEMeter; Peak Reflow Temperature (Cel): 260°C; Surface Mount: Yes; Technology: BICMOS; Terminal Form: No Lead; Terminal Position: DUAL; Length: 3mm; Width: 3mm; Height - Seated (Max): 0.8mm; Terminal Pitch: 0.65mm; Temperature Grade: INDUSTRIAL; Reach SVHC Compliant: Yes; RoHS Compliant: Yes; ComponentLink1URL: https://datasheet.ciiva.com:443/pdfs/VipMasterIC/IC/MAXM/MAXMS12627/MAXMS12627-1.pdf?src-supplier=IHS+Markit; ComponentLink1Description: https://datasheet.ciiva.com:443/pdfs/VipMasterIC/IC/MAXM/MAXMS12627/MAXMS12627-1.pdf?src-supplier=IHS+Markit; ComponentLink2URL: https://datasheet.ciiva.com/1481/388069-1481331.pdf?src-supplier=Element14; ComponentLink2Description: https://datasheet.ciiva.com/1481/388069-1481331.pdf?src-supplier=Element14; ComponentLink3URL: https://datasheet.ciiva.com/1790/max9716-max9717-1790242.pdf?src-supplier=Digikey; ComponentLink3Description: https://datasheet.ciiva.com/1790/max9716-max9717-1790242.pdf?src-supplier=Digikey; ComponentLink4URL: https://datasheet.ciiva.com/1790/max9716-max9717-1790243.pdf?src-supplier=Digikey; ComponentLink4Description: https://datasheet.ciiva.com/1790/max9716-max9717-1790243.pdf?src-supplier=Digikey; ComponentLink5URL: https://datasheet.ciiva.com/1790/max9716-max9717-1790244.pdf?src-supplier=Digikey; ComponentLink5Description: https://datasheet.ciiva.com/1790/max9716-max9717-1790244.pdf?src-supplier=Digikey; ComponentLink6URL: https://datasheet.ciiva.com/2968/max9716-max9717-2968854.pdf?src-supplier=Avnet; ComponentLink6Description: https://datasheet.ciiva.com/2968/max9716-max9717-2968854.pdf?src-supplier=Avnet; Supplier 1: Digikey; Supplier Part Number 1: MAX9716ETA+TCT-ND; Pricing 1: 1=1.28, 10=1.15, 25=1.08, 100=0.92